# Altium schematic sheet VerticalPCBConnection.SchDoc
size Letter; Organization: Ploopy Corporation; Address1: 137-1140 Burnhamthorpe Road W; Address3: Ontario; DocumentNumber: 5; Revision: R1.007; SheetNumber: 5; SheetTotal: 5
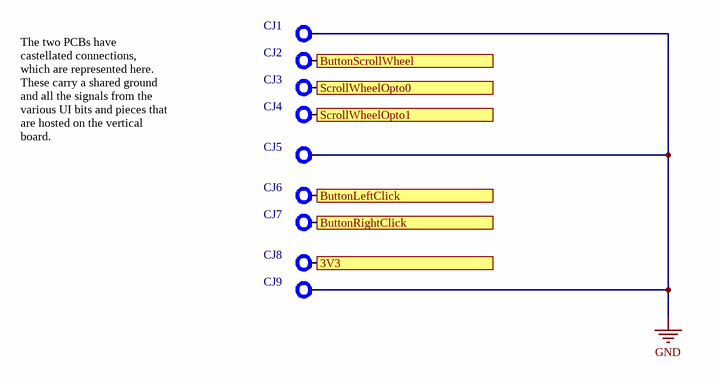
[diagram p0: VerticalPCBConnection.SchDoc]

## Parts
CJ1  PCBJointCastellationJoint  [PCBJoint]  (value not drawn)  (no BOM)
CJ2  PCBJointCastellationJoint  [PCBJoint]  (value not drawn)  (no BOM)
CJ3  PCBJointCastellationJoint  [PCBJoint]  (value not drawn)  (no BOM)
CJ4  PCBJointCastellationJoint  [PCBJoint]  (value not drawn)  (no BOM)
CJ5  PCBJointCastellationJoint  [PCBJoint]  (value not drawn)  (no BOM)
CJ6  PCBJointCastellationJoint  [PCBJoint]  (value not drawn)  (no BOM)
CJ7  PCBJointCastellationJoint  [PCBJoint]  (value not drawn)  (no BOM)
CJ8  PCBJointCastellationJoint  [PCBJoint]  (value not drawn)  (no BOM)
CJ9  PCBJointCastellationJoint  [PCBJoint]  (value not drawn)  (no BOM)

## Ports
3V3 (out), ButtonLeftClick (in), ButtonRightClick (in), ButtonScrollWheel (in), ScrollWheelOpto0 (in), ScrollWheelOpto1 (in)

## Nets
GND: CJ1.1 CJ5.1 CJ9.1
3V3: CJ8.1 ; port 3V3
ButtonLeftClick: CJ6.1 ; port ButtonLeftClick
ButtonRightClick: CJ7.1 ; port ButtonRightClick
ButtonScrollWheel: CJ2.1 ; port ButtonScrollWheel
ScrollWheelOpto0: CJ3.1 ; port ScrollWheelOpto0
ScrollWheelOpto1: CJ4.1 ; port ScrollWheelOpto1

## Notes on the sheet
- The two PCBs have castellated connections, which are represented here. These carry a shared ground and all the signals from the various UI bits and pieces that are hosted on the vertical board.
- Copyright Ploopy Corporation 2024
- Licensed under the CERN-OHL-S v2
- http://ohwr.org/cernohl
- Title:
- PCB:
- Version:
- Ploopy Corporation
- Mississauga ON L5C 0A3
- 137-1140 Burnhamthorpe Road W
- Date:
- Time:
- Sheet
- of
- Canada

## Library data of the parts
CJ1-CJ9 = PCBJoint: Pad for soldering a castellated PCB edge. Easy way to join two PCBs together.